# EAGLE design proxmark3o_devboard (EAGLE 5.11)

## Sheet 1 of 4
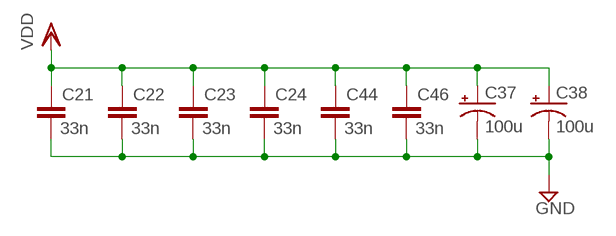
[diagram p0: schematic, sheet 1]

### Parts
C21  33n  CAPACITOR0603  [RLC_0603]
C22  33n  CAPACITOR0603  [RLC_0603]
C23  33n  CAPACITOR0603  [RLC_0603]
C24  33n  CAPACITOR0603  [RLC_0603]
C37  100u  CAPACITOR-POLARIZEDALCHIP-MZA-F80  [CAPCAITOR-ELECTROLYTIC-ALCHIP-MZA-F80]
C38  100u  CAPACITOR-POLARIZEDALCHIP-MZA-F80  [CAPCAITOR-ELECTROLYTIC-ALCHIP-MZA-F80]
C44  33n  CAPACITOR0603  [RLC_0603]
C46  33n  CAPACITOR0603  [RLC_0603]

### Nets
GND: C21.2 C22.2 C23.2 C24.2 C37.- C38.- C44.2 C46.2 ; also sheet 2,3,4
VDD: C21.1 C22.1 C23.1 C24.1 C37.+ C38.+ C44.1 C46.1 ; also sheet 2,3,4

## Sheet 2 of 4
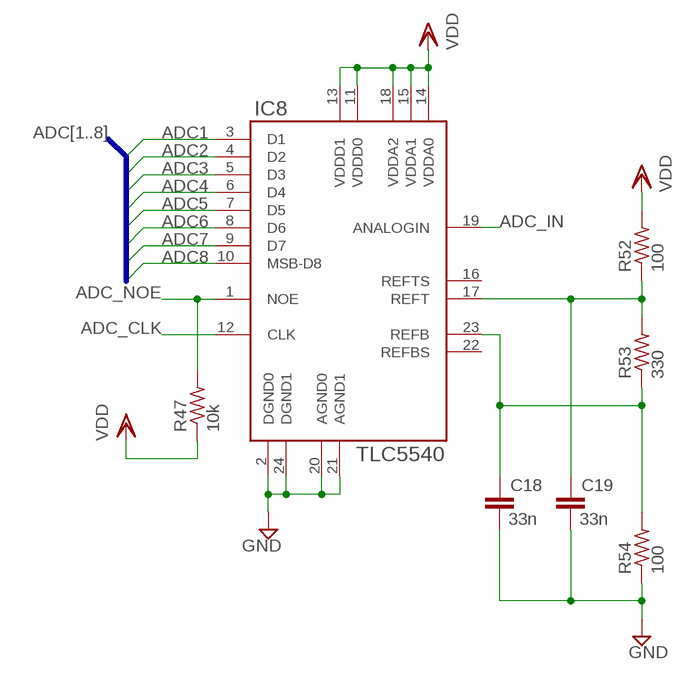
[diagram p1: schematic, sheet 2]

### Parts
C18  33n  CAPACITOR0603  [RLC_0603]
C19  33n  CAPACITOR0603  [RLC_0603]
IC8  TLC5540  [TSSOP-24]
R47  10k  RESISTOR0603  [RLC_0603]
R52  100  RESISTOR0603  [RLC_0603]
R53  330  RESISTOR0603  [RLC_0603]
R54  100  RESISTOR0603  [RLC_0603]

### Nets
ADC1: IC8.3(D1)
ADC2: IC8.4(D2)
ADC3: IC8.5(D3)
ADC4: IC8.6(D4)
ADC5: IC8.7(D5)
ADC6: IC8.8(D6)
ADC7: IC8.9(D7)
ADC8: IC8.10(MSB-D8)
ADC_CLK: IC8.12(CLK)
ADC_IN: IC8.19(ANALOGIN) ; also sheet 3
ADC_NOE: IC8.1(NOE) R47.2
GND: C18.2 C19.2 IC8.2(DGND0) IC8.20(AGND0) IC8.21(AGND1) IC8.24(DGND1) R54.1 ; also sheet 1,3,4
N$24: C18.1 IC8.23(REFB) R53.1 R54.2
N$48: C19.1 IC8.17(REFT) R52.1 R53.2
VDD: IC8.11(VDDD0) IC8.13(VDDD1) IC8.14(VDDA0) IC8.15(VDDA1) IC8.18(VDDA2) R47.1 R52.2 ; also sheet 1,3,4
Unconnected: IC8.16(REFTS) IC8.22(REFBS)

### Buses
ADC[1..8]

## Sheet 3 of 4
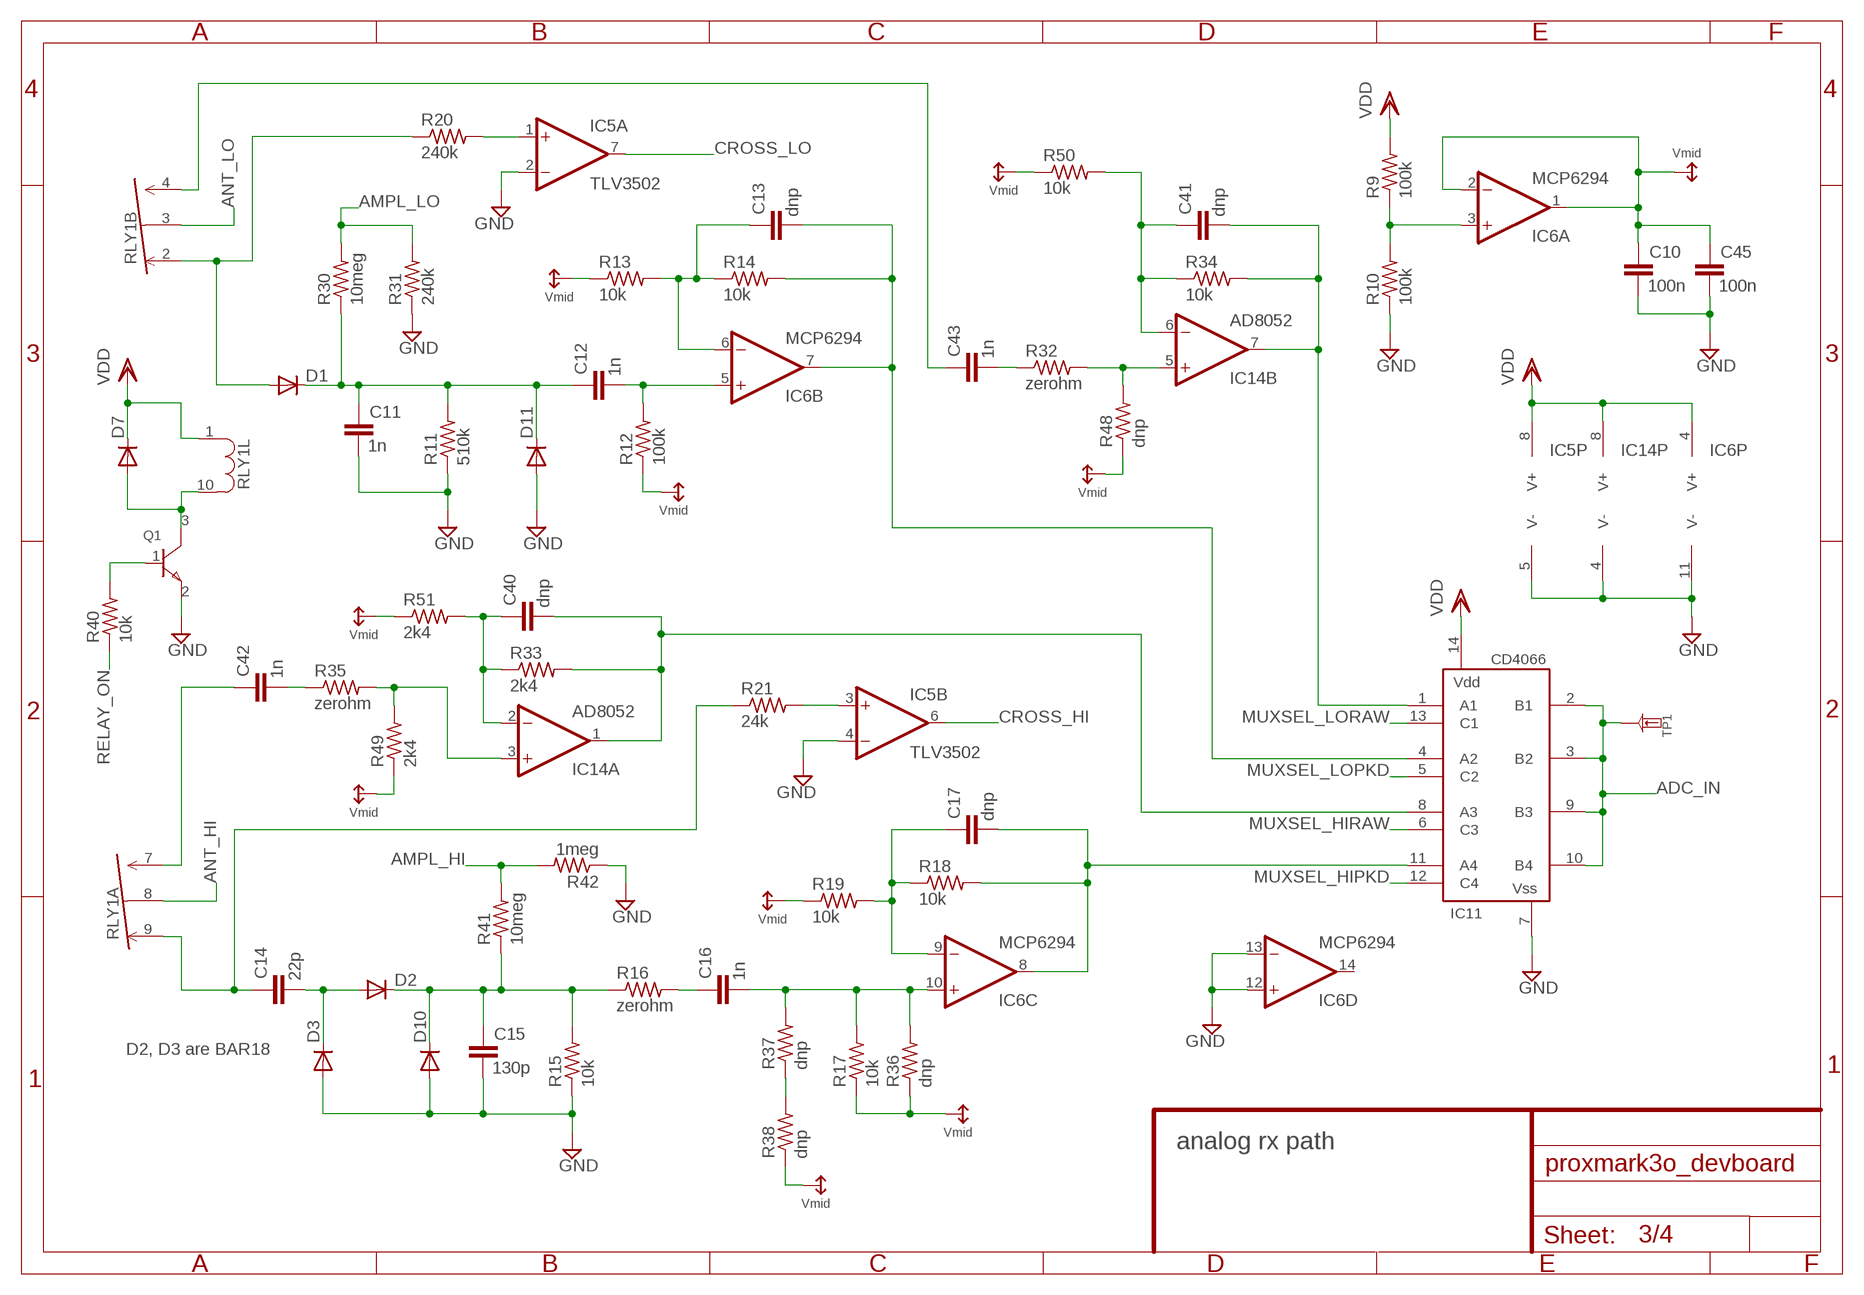
[diagram p2: schematic, sheet 3]

### Parts
C10  100n  CAPACITOR0603  [RLC_0603]
C11  1n  CAPACITOR0603  [RLC_0603]
C12  1n  CAPACITOR0603  [RLC_0603]
C13  dnp  CAPACITOR0603  [RLC_0603]
C14  22p  CAPACITOR0603  [RLC_0603]
C15  130p  CAPACITOR0603  [RLC_0603]
C16  1n  CAPACITOR0603  [RLC_0603]
C17  dnp  CAPACITOR0603  [RLC_0603]
C40  dnp  CAPACITOR0603  [RLC_0603]
C41  dnp  CAPACITOR0603  [RLC_0603]
C42  1n  CAPACITOR0603  [RLC_0603]
C43  1n  CAPACITOR0603  [RLC_0603]
C45  100n  CAPACITOR0603  [RLC_0603]
D1  DIODE-SMD-SOT23  [SOT23-3LEAD]
D2  DIODE-SMD-SOT23  [SOT23-3LEAD]
D3  DIODE-SMD-SOT23  [SOT23-3LEAD]
D7  DIODE-SMD-SOT23  [SOT23-3LEAD]
D10  DIODE-SMD-SOT23  [SOT23-3LEAD]
D11  DIODE-SMD-SOT23  [SOT23-3LEAD]
IC5  TLV3502  COMP-TLV3502SOT-23-8-OR-MSOP-8  [SOT-23-8-OR-MSOP-8]
IC6  MCP6294  OPAMP-TLC2274  [TSSOP-14]
IC11  CD4066  [TSSOP-14]
IC14  AD8052  OPAMP-AD8052  [MSOP8]
Q1  NPN-SOT23-2N3904  [SOT23-3LEAD]
R9  100k  RESISTOR0603  [RLC_0603]
R10  100k  RESISTOR0603  [RLC_0603]
R11  510k  RESISTOR0603  [RLC_0603]
R12  100k  RESISTOR0603  [RLC_0603]
R13  10k  RESISTOR0603  [RLC_0603]
R14  10k  RESISTOR0603  [RLC_0603]
R15  10k  RESISTOR0603  [RLC_0603]
R16  zerohm  RESISTOR0603  [RLC_0603]
R17  10k  RESISTOR0603  [RLC_0603]
R18  10k  RESISTOR0603  [RLC_0603]
R19  10k  RESISTOR0603  [RLC_0603]
R20  240k  RESISTOR0603  [RLC_0603]
R21  24k  RESISTOR0603  [RLC_0603]
R30  10meg  RESISTOR0603  [RLC_0603]
R31  240k  RESISTOR0603  [RLC_0603]
R32  zerohm  RESISTOR0603  [RLC_0603]
R33  2k4  RESISTOR0603  [RLC_0603]
R34  10k  RESISTOR0603  [RLC_0603]
R35  zerohm  RESISTOR0603  [RLC_0603]
R36  dnp  RESISTOR0603  [RLC_0603]
R37  dnp  RESISTOR0603  [RLC_0603]
R38  dnp  RESISTOR0603  [RLC_0603]
R40  10k  RESISTOR0603  [RLC_0603]
R41  10meg  RESISTOR0603  [RLC_0603]
R42  1meg  RESISTOR0603  [RLC_0603]
R48  dnp  RESISTOR0603  [RLC_0603]
R49  2k4  RESISTOR0603  [RLC_0603]
R50  10k  RESISTOR0603  [RLC_0603]
R51  2k4  RESISTOR0603  [RLC_0603]
RLY1  RELAY-DPDT  [TQ-SMD-RELAY]
TP1  TESTPADKEYSTONE-SMD  [KEYSTONE-SMD-TESTPOINT-5015]

### Nets
ADC_IN: IC11.2(B1) IC11.3(B2) IC11.9(B3) IC11.10(B4) TP1.1 ; also sheet 2
ADCDR_HI: C17.2 IC6.8(C:OUT) IC11.11(A4) R18.2
ADCDR_LO: C13.2 IC6.7(B:OUT) IC11.4(A2) R14.2
AMPL_HI: R41.2 R42.2
AMPL_LO: R30.2 R31.2
ANT_HI: RLY1.8(A:COM) ; also sheet 4
ANT_LO: RLY1.3(B:COM) ; also sheet 4
CROSS_HI: IC5.6(B:OUT)
CROSS_LO: IC5.7(A:OUT)
GND: C10.2 C11.2 C15.2 C45.2 D3.1(A) D10.1(A) D11.1(A) IC5.2(A:-IN) IC5.4(B:-IN) IC5.5(P:V-) IC6.11(P:V-) IC6.12(D:+IN) IC6.13(D:-IN) IC11.7(VSS) IC14.4(P:V-) Q1.2(E) R10.1 R11.1 R15.1 R31.1 R42.1 ; also sheet 1,2,4
MUXSEL_HIPKD: IC11.12(C4)
MUXSEL_HIRAW: IC11.6(C3)
MUXSEL_LOPKD: IC11.5(C2)
MUXSEL_LORAW: IC11.13(C1)
N$14: IC6.3(A:+IN) R9.1 R10.2
N$15: C17.1 IC6.9(C:-IN) R18.1 R19.2
N$16: C12.2 IC6.5(B:+IN) R12.2
N$17: C13.1 IC6.6(B:-IN) R13.2 R14.1
N$18: C16.1 R16.2
N$19: C11.1 C12.1 D1.3(C) D11.3(C) R11.2 R30.1
N$20: C14.2 D2.1(A) D3.3(C)
N$21: C15.1 D2.3(C) D10.3(C) R15.2 R16.1 R41.1
N$22: C16.2 IC6.10(C:+IN) R17.2 R36.2 R37.2
N$23: IC5.1(A:+IN) R20.2
N$26: IC5.3(B:+IN) R21.2
N$35: D7.1(A) Q1.3(C) RLY1.10
N$36: C14.1 R21.1 RLY1.9(A:NC)
N$37: C42.1 RLY1.7(A:NO)
N$38: Q1.1(B) R40.2
N$39: D1.1(A) R20.1 RLY1.2(B:NC)
N$43: C41.2 IC11.1(A1) IC14.7(B:OUT) R34.2
N$46: C43.1 RLY1.4(B:NO)
N$47: IC14.3(A:+IN) R35.2 R49.2
N$50: C43.2 R32.1
N$51: C42.2 R35.1
N$52: C40.1 IC14.2(A:-IN) R33.1 R51.2
N$53: C41.1 IC14.6(B:-IN) R34.1 R50.2
N$54: IC14.5(B:+IN) R32.2 R48.2
N$56: R37.1 R38.2
RAW_HI: C40.2 IC11.8(A3) IC14.1(A:OUT) R33.2
RELAY_ON: R40.1
VDD: D7.3(C) IC5.8(P:V+) IC6.4(P:V+) IC11.14(VDD) IC14.8(P:V+) R9.2 RLY1.1 ; also sheet 1,2,4
VMID: C10.1 C45.1 IC6.1(A:OUT) IC6.2(A:-IN) R12.1 R13.1 R17.1 R19.1 R36.1 R38.1 R48.1 R49.1 R50.1 R51.1 ; supply symbol labelled SUPPLY_VMID
Unconnected: IC6.14(D:OUT)

### Notes on the sheet
- D2, D3 are BAR18
- analog rx path

## Sheet 4 of 4
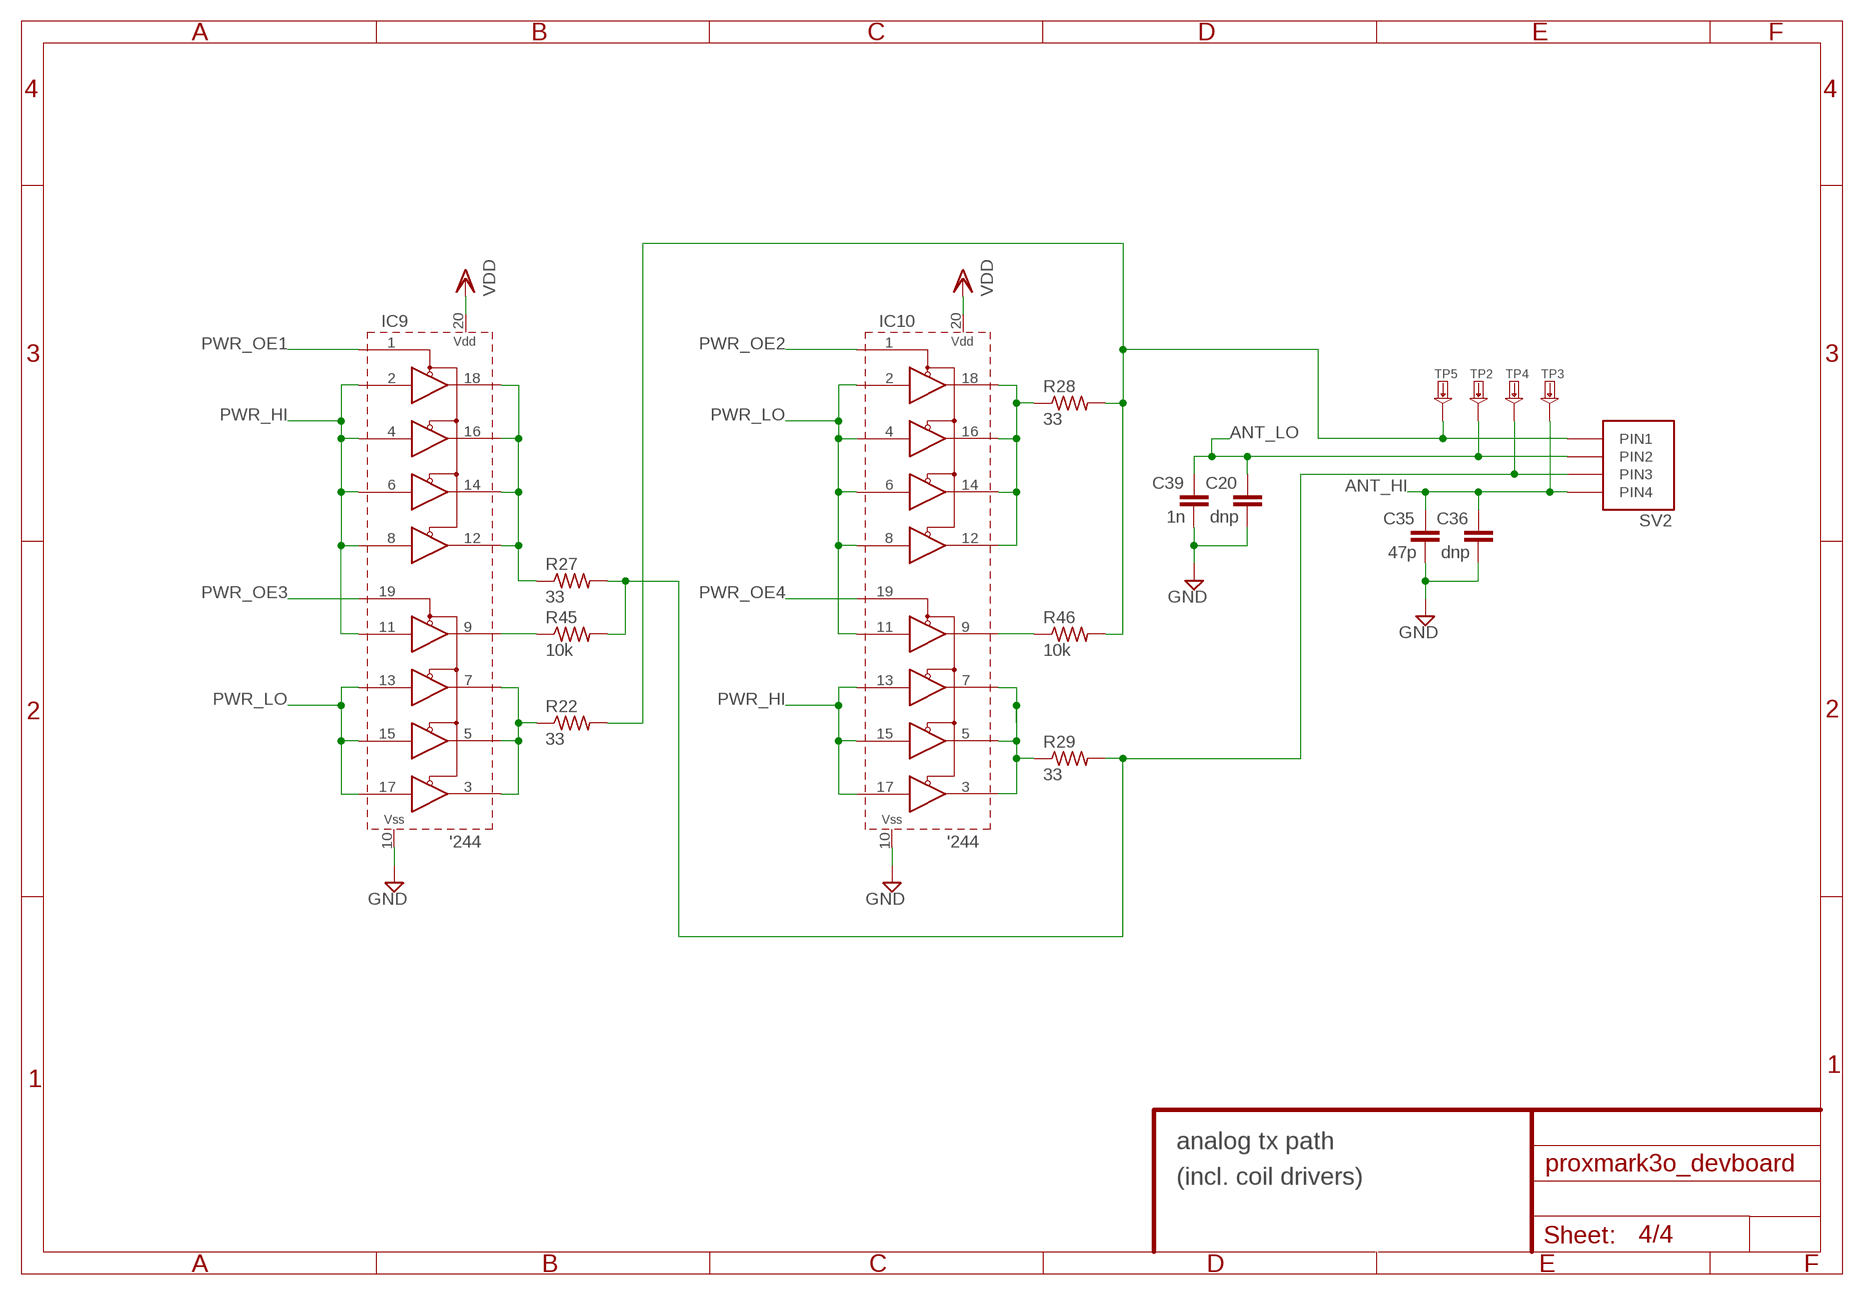
[diagram p3: schematic, sheet 4]

### Parts
C20  dnp  CAPACITOR0603  [RLC_0603]
C35  47p  CAPACITOR0603  [RLC_0603]
C36  dnp  CAPACITOR0603  [RLC_0603]
C39  1n  CAPACITOR0603  [RLC_0603]
IC9  74XX244-OCTAL-TRISTATE-BUFFERS  [TSSOP-20]
IC10  74XX244-OCTAL-TRISTATE-BUFFERS  [TSSOP-20]
R22  33  RESISTOR0603  [RLC_0603]
R27  33  RESISTOR0603  [RLC_0603]
R28  33  RESISTOR0603  [RLC_0603]
R29  33  RESISTOR0603  [RLC_0603]
R45  10k  RESISTOR0603  [RLC_0603]
R46  10k  RESISTOR0603  [RLC_0603]
SV2  HIROSE-MQ172-4POS  [HIROSE-MQ172-4POS]
TP2  TESTPADKEYSTONE-SMD  [KEYSTONE-SMD-TESTPOINT-5015]
TP3  TESTPADKEYSTONE-SMD  [KEYSTONE-SMD-TESTPOINT-5015]
TP4  TESTPADKEYSTONE-SMD  [KEYSTONE-SMD-TESTPOINT-5015]
TP5  TESTPADKEYSTONE-SMD  [KEYSTONE-SMD-TESTPOINT-5015]

### Nets
ANT_HI: C35.1 C36.1 SV2.4(PIN4) TP3.1 ; also sheet 3
ANT_LO: C20.1 C39.1 SV2.2(PIN2) TP2.1 ; also sheet 3
GND: C20.2 C35.2 C36.2 C39.2 IC9.10(VSS) IC10.10(VSS) ; also sheet 1,2,3
N$31: R27.2 R29.2 R45.2 SV2.3(PIN3) TP4.1
N$32: R22.2 R28.2 R46.2 SV2.1(PIN1) TP5.1
N$33: IC9.12(1Y4) IC9.14(1Y3) IC9.16(1Y2) IC9.18(1Y1) R27.1
N$34: IC10.12(1Y4) IC10.14(1Y3) IC10.16(1Y2) IC10.18(1Y1) R28.1
N$41: IC9.3(2Y4) IC9.5(2Y3) IC9.7(2Y2) R22.1
N$42: IC10.3(2Y4) IC10.5(2Y3) IC10.7(2Y2) R29.1
N$44: IC9.9(2Y1) R45.1
N$45: IC10.9(2Y1) R46.1
PWR_HI: IC9.2(1A1) IC9.4(1A2) IC9.6(1A3) IC9.8(1A4) IC9.11(2A1) IC10.13(2A2) IC10.15(2A3) IC10.17(2A4)
PWR_LO: IC9.13(2A2) IC9.15(2A3) IC9.17(2A4) IC10.2(1A1) IC10.4(1A2) IC10.6(1A3) IC10.8(1A4) IC10.11(2A1)
PWR_OE1: IC9.1(1NOE)
PWR_OE2: IC10.1(1NOE)
PWR_OE3: IC9.19(2NOE)
PWR_OE4: IC10.19(2NOE)
VDD: IC9.20(VDD) IC10.20(VDD) ; also sheet 1,2,3

### Notes on the sheet
- analog tx path
- (incl. coil drivers)

## Library data of the parts
C10-C24 C35 C36 C39-C46 =   merged:CAPACITOR
C37 C38 =   merged:CAPACITOR-POLARIZED
D1-D3 D7 D10 D11 =   merged:DIODE-SMD-SOT23
IC5 =   merged:COMP-TLV3502
IC6 =   merged:OPAMP-TLC2274
IC8 =   merged:TLC5540
IC9 IC10 =   merged:74XX244-OCTAL-TRISTATE-BUFFERS
IC11 =   merged:CD4066
IC14 =   merged:OPAMP-AD8052
Q1 =   merged:NPN-SOT23-2N3904
R9-R22 R27-R38 R40-R42 R45-R54 =   merged:RESISTOR
RLY1 =   merged:RELAY-DPDT
SV2 =   merged:HIROSE-MQ172-4POS
TP1-TP5 =   merged:TESTPAD

## Board
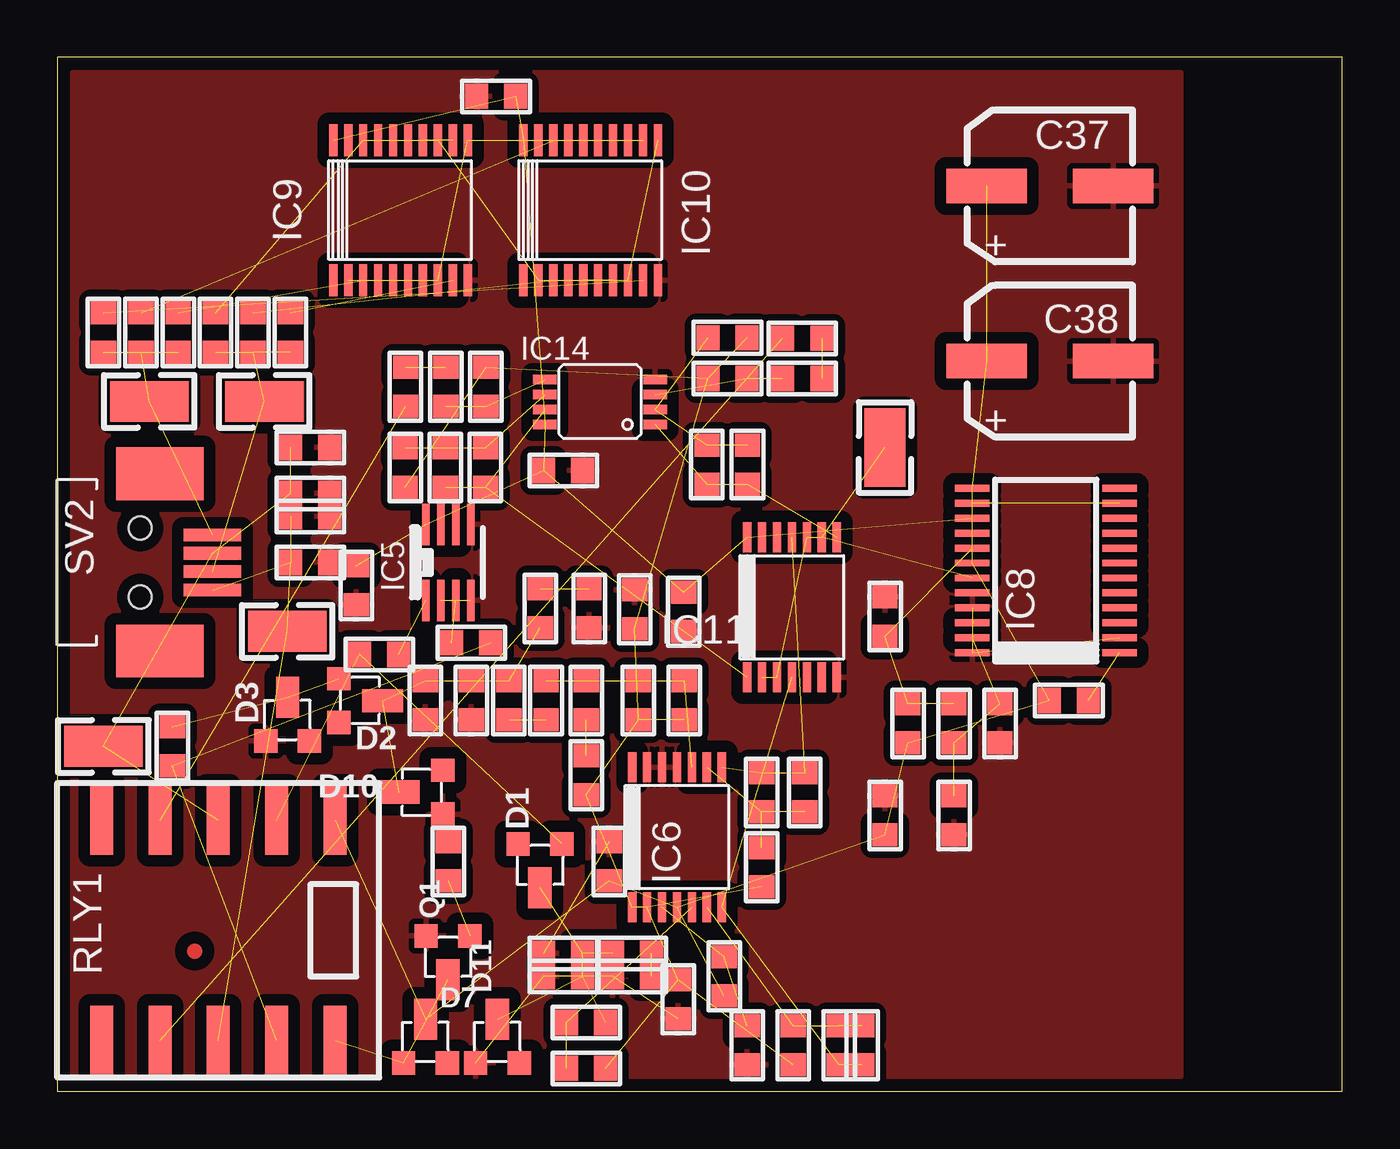
[diagram p4: board, top side]
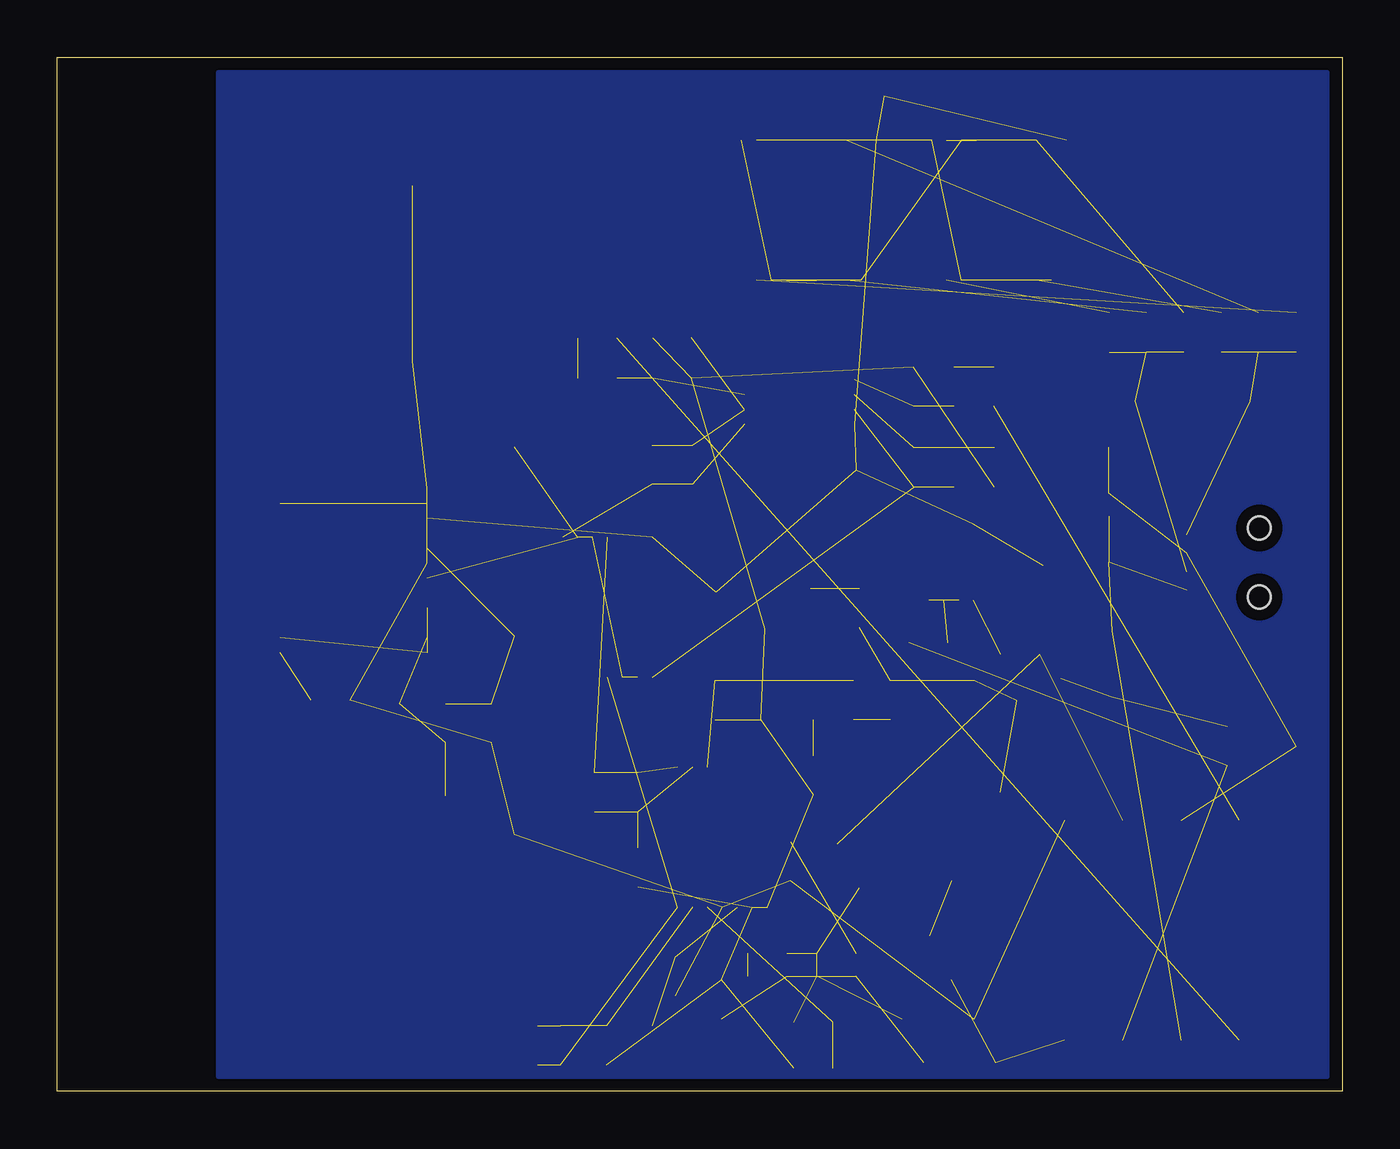
[diagram p5: board, bottom side, seen from below]

Size 55.88 x 44.96 mm. Coordinates in mm from the lower left corner, seen from the top.
Outline: 55.88,0 55.88,44.96 0,44.96 0,0 55.88,0
Copper layers (1*16): Top 0.035mm / dielectric 1.5mm / Bottom 0.035mm
Design rules "ITead_rule": minimum track width 6mil, minimum drill 12mil, track to track 6mil, track to pad 6mil, pad to pad 6mil, via to via 6mil, smd to smd 0mil, copper to edge 10mil, drill to drill 10mil, minimum pad ring 10mil, minimum via ring 6mil, stop-mask expansion 2mil, vias tented up to drill 100mil, thermal gap 10mil

### Footprints (pad centres in the part's own frame; a part is rotated, then mirrored left to right if it is on the bottom)
RLC_0603 = smd 1 x 1.1: 1 -0.85,0; 2 0.85,0
CAPCAITOR-ELECTROLYTIC-ALCHIP-MZA-F80 = smd 3.5 x 1.5: + 2.75,0; - -2.75,0
SOT23-3LEAD = smd 1.016 x 1.016: 1 -0.94,-0.762; 2 0.965,-0.762 | smd 1.016 x 1.778: 3 0.013,1.143
SOT-23-8-OR-MSOP-8 = smd 0.325 x 1.8: 1 -0.975,-1.65; 2 -0.325,-1.65; 3 0.325,-1.65; 4 0.975,-1.65; 5 0.975,1.65; 6 0.325,1.65; 7 -0.325,1.65; 8 -0.975,1.65
TSSOP-14 = smd 1.3 x 0.36: 1 0,0; 2 0,-0.65; 3 0,-1.3; 4 0,-1.95; 5 0,-2.6; 6 0,-3.25; 7 0,-3.9; 8 6.095,-3.9; 9 6.095,-3.25; 10 6.095,-2.6; 11 6.095,-1.95; 12 6.095,-1.3; 13 6.095,-0.65; 14 6.095,0
TSSOP-24 = smd 0.3 x 1.5: 1 -2.925,-3.2; 2 -2.275,-3.2; 3 -1.625,-3.2; 4 -0.975,-3.2; 5 -0.325,-3.2; 6 0.325,-3.2; 7 0.975,-3.2; 8 1.625,-3.2; 9 2.275,-3.2; 10 2.925,-3.2; 11 3.575,-3.2; 12 4.225,-3.2; 13 4.225,3.2; 14 3.575,3.2; 15 2.925,3.2; 16 2.275,3.2; 17 1.625,3.2; 18 0.975,3.2; 19 0.325,3.2; 20 -0.325,3.2; 21 -0.975,3.2; 22 -1.625,3.2; 23 -2.275,3.2; 24 -2.925,3.2
TSSOP-20 = smd 1.4 x 0.36: 1 0,0; 2 0,-0.65; 3 0,-1.3; 4 0,-1.95; 5 0,-2.6; 6 0,-3.25; 7 0,-3.9; 8 0,-4.55; 9 0,-5.2; 10 0,-5.85; 11 6.095,-5.85; 12 6.095,-5.2; 13 6.095,-4.55; 14 6.095,-3.9; 15 6.095,-3.25; 16 6.095,-2.6; 17 6.095,-1.95; 18 6.095,-1.3; 19 6.095,-0.65; 20 6.095,0
MSOP8 = smd 0.41 x 1.02: 1 0,0; 2 0.65,0; 3 1.3,0; 4 1.95,0; 5 1.95,4.8; 6 1.3,4.8; 7 0.65,4.8; 8 0,4.8
TQ-SMD-RELAY = smd 1 x 3: 1 -5.08,-4.78; 2 -2.54,-4.78; 3 0,-4.78; 4 2.54,-4.78; 5 5.08,-4.78; 6 5.08,4.78; 7 2.54,4.78; 8 0,4.78; 9 -2.54,4.78; 10 -5.08,4.78
HIROSE-MQ172-4POS = smd 0.55 x 2.5: 1 -1.2,6.75; 2 -0.4,6.75; 3 0.4,6.75; 4 1.2,6.75 | smd 2.3 x 3.8: P$1 -3.85,4.45; P$2 3.85,4.45 | hole 1: -1.5,3.6; 1.5,3.6
KEYSTONE-SMD-TESTPOINT-5015 = smd 3.429 x 1.778: 1 0,0

### Placement (x,y rotation side)
C10  27,4 270 top
C11  22,6 180 top
C12  23,3 180 top
C13  35,2 270 top
C14  5,15 90 top
C15  16,17 270 top
C16  21.25,17 90 top
C17  32.51,13 90 top
C18  41,16 270 top
C19  36,20.65 90 top
C20  11,28 0 top
C21  24,10 90 top
C22  22,27 0 top
C23  13,22 270 top
C24  27.24,20.86 270 top
C35  11,25 0 top
C36  11,23 0 top
C37  43.18,39.37 180 top
C38  43.18,31.75 180 top
C39  11,26 0 top
C40  30.02,27.25 270 top
C41  18.62,27.13 270 top
C42  32.4,32.75 0 top
C43  15.14,30.64 90 top
C44  36,12 90 top
C45  25.11,20.97 90 top
C46  19.08,43.27 180 top
D1  21,10 180 top
D2  13,17 270 top
D3  10,16 0 top
D7  16,2 0 top
D10  16,13 90 top
D11  19.13,2 0 top
IC5  17,23 0 top
IC6  25,8 90 top
IC8  43,22 90 top
IC9  12,35.27 90 top
IC10  20.27,35.27 90 top
IC11  30,18 90 top
IC14  26,29 90 top
Q1  17,6 180 top
R9  29,5 270 top
R10  30,2 90 top
R11  22,5 0 top
R12  23,1 180 top
R13  32,2 90 top
R14  34,2 270 top
R15  18,17 90 top
R16  19.64,17 270 top
R17  25.27,17 90 top
R18  30.64,13 90 top
R19  30.64,9.75 90 top
R20  14,19 0 top
R21  18,19.51 180 top
R22  5.25,33 270 top
R27  6.87,33 270 top
R28  3.63,33 270 top
R29  8.51,33 270 top
R30  25,6 0 top
R31  25,5 0 top
R32  16.89,30.64 270 top
R33  28.25,27.25 270 top
R34  16.87,27.13 270 top
R35  32.4,31 180 top
R36  27.27,17 90 top
R37  23,17 90 top
R38  23,13.75 90 top
R40  17,10 270 top
R41  21,21 90 top
R42  23.13,21 90 top
R45  10.13,33 270 top
R46  2,33 270 top
R47  44,17 0 top
R48  18.64,30.64 270 top
R49  29.14,31 0 top
R50  15.13,27.13 90 top
R51  29.15,32.77 180 top
R52  37,16 270 top
R53  39,16 90 top
R54  39,12 90 top
RLY1  7,7 180 top
SV2  0,23 270 top
TP1  36,28 90 top
TP2  2,15 180 top
TP3  10,20 180 top
TP4  9,30 180 top
TP5  4,30 180 top

### Tracks (layer width: path | path; a pad name or v marks a point on that pad's centre or on a via)
ADC_IN  (5 unrouted)
ADC_NOE  (1 unrouted)
ADCDR_HI  (3 unrouted)
ADCDR_LO  (3 unrouted)
AMPL_HI  (1 unrouted)
AMPL_LO  (1 unrouted)
ANT_HI  (4 unrouted)
ANT_LO  (4 unrouted)
GND  (7 unrouted)
  pour Top (isolate 0.508): 0.64,44.32 0.64,0.64 48.9,0.64 48.9,44.32
  pour Bottom (isolate 0.508): 0.64,44.32 0.64,0.64 48.9,0.64 48.9,44.32
N$14  (2 unrouted)
N$15  (3 unrouted)
N$16  (2 unrouted)
N$17  (3 unrouted)
N$18  (1 unrouted)
N$19  (5 unrouted)
N$20  (2 unrouted)
N$21  (5 unrouted)
N$22  (4 unrouted)
N$23  (1 unrouted)
N$24  (3 unrouted)
N$26  (1 unrouted)
N$31  (4 unrouted)
N$32  (4 unrouted)
N$33  (4 unrouted)
N$34  (4 unrouted)
N$35  (2 unrouted)
N$36  (2 unrouted)
N$37  (1 unrouted)
N$38  (1 unrouted)
N$39  (2 unrouted)
N$41  (3 unrouted)
N$42  (3 unrouted)
N$43  (3 unrouted)
N$44  (1 unrouted)
N$45  (1 unrouted)
N$46  (1 unrouted)
N$47  (2 unrouted)
N$48  (3 unrouted)
N$50  (1 unrouted)
N$51  (1 unrouted)
N$52  (3 unrouted)
N$53  (3 unrouted)
N$54  (2 unrouted)
N$56  (1 unrouted)
PWR_HI  (7 unrouted)
PWR_LO  (7 unrouted)
RAW_HI  (3 unrouted)
VDD  (23 unrouted)
VMID  (13 unrouted)
(copper drawn outside any net)
  shapes: Top circle x1